# EAGLE design W506E (EAGLE 6.6.0)
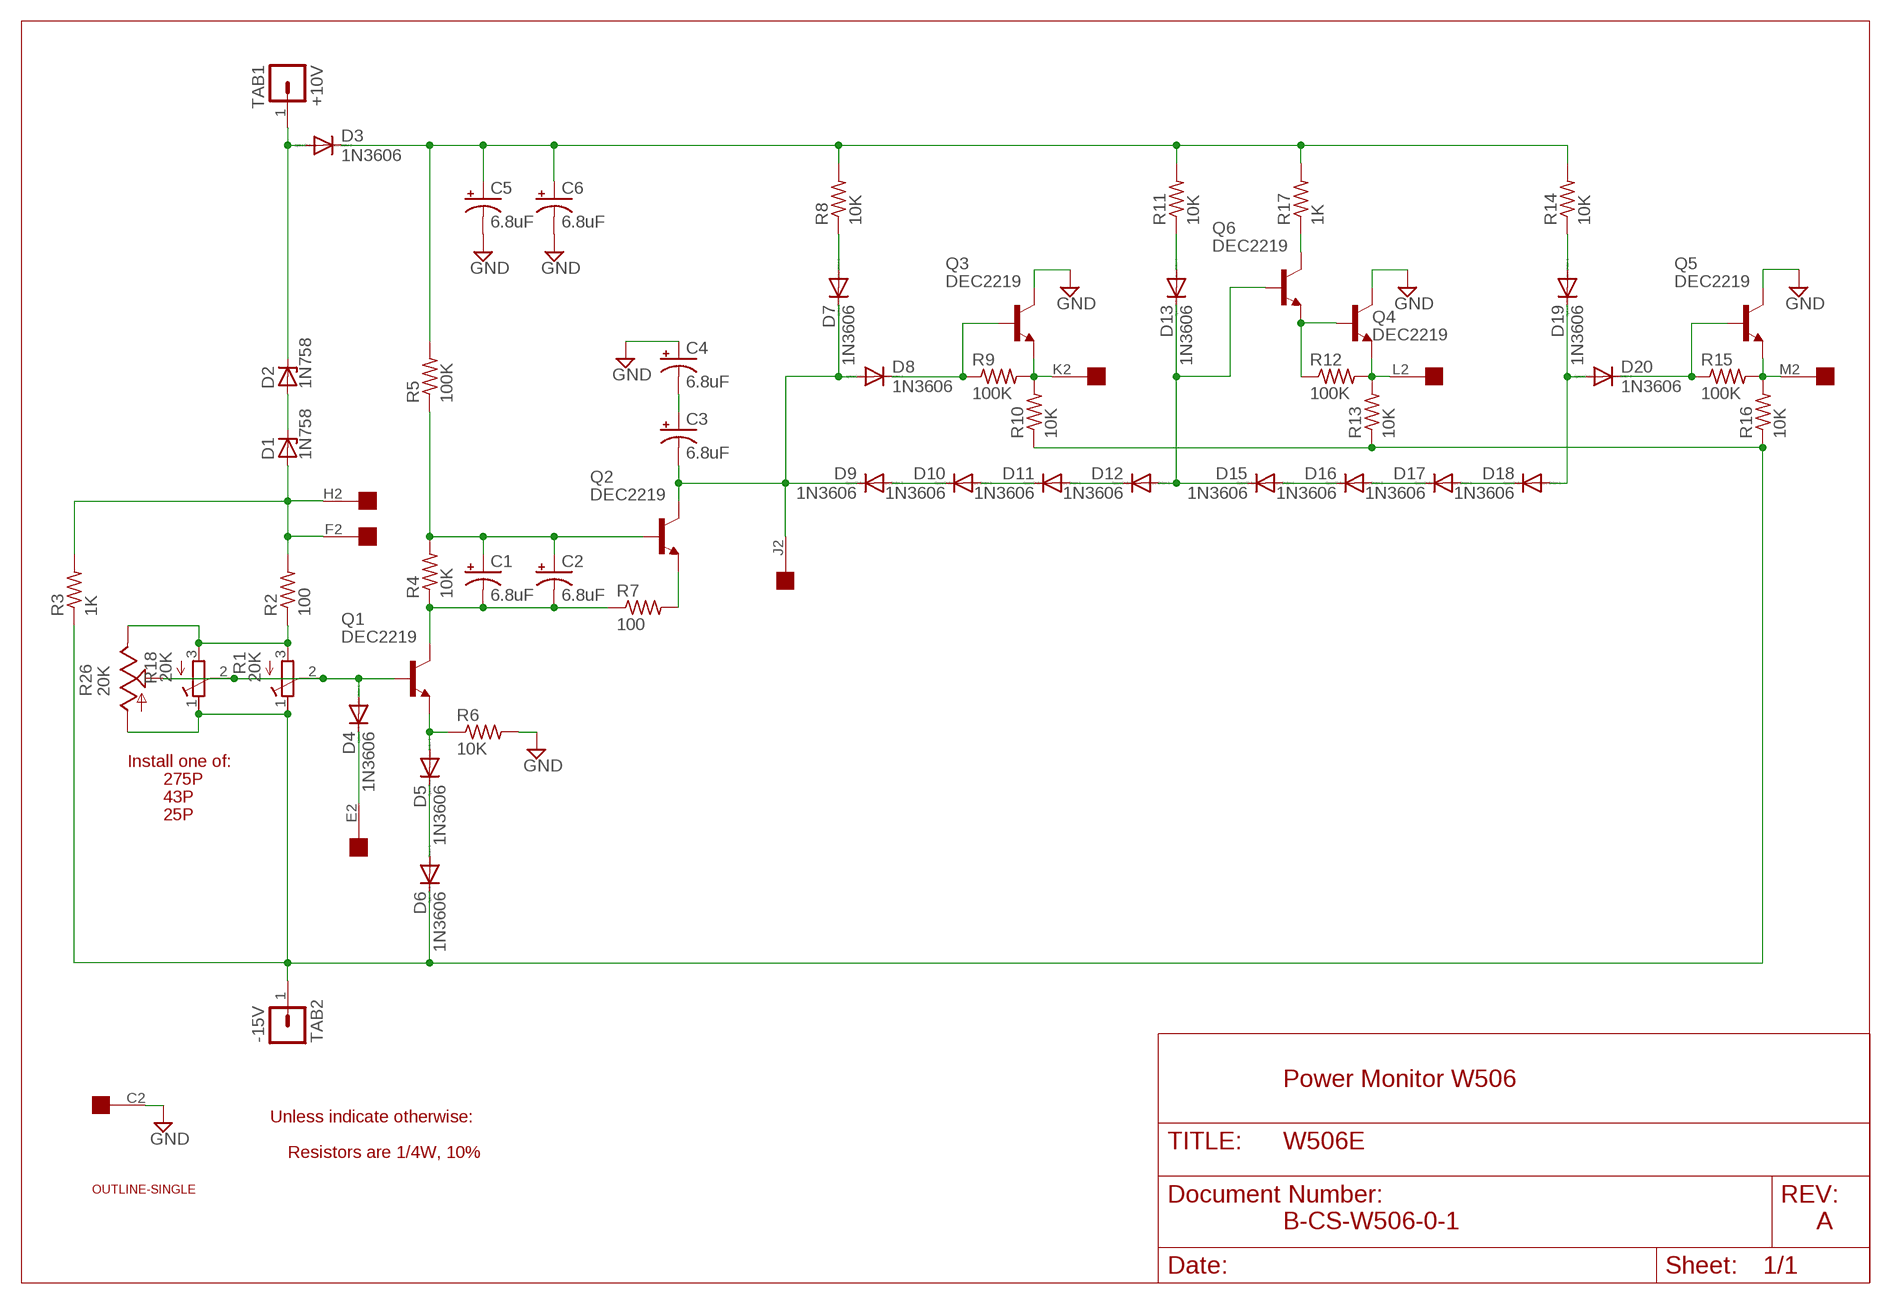
[diagram p0: schematic, sheet 1]

## Parts
C1  6.8uF  CPOL-USE15-5AXIAL  [E15-5]
C2  6.8uF  CPOL-USE15-5AXIAL  [E15-5]
C3  6.8uF  CPOL-USE15-5AXIAL  [E15-5]
C4  6.8uF  CPOL-USE15-5AXIAL  [E15-5]
C5  6.8uF  CPOL-USE15-5AXIAL  [E15-5]
C6  6.8uF  CPOL-USE15-5AXIAL  [E15-5]
D1  1N758  ZENER-DIODEDO35Z10  [DO35Z10]
D2  1N758  ZENER-DIODEDO35Z10  [DO35Z10]
D3  1N3606  1N4148DO35-10  [DO35-10]
D4  1N3606  1N4148DO35-10  [DO35-10]
D5  1N3606  1N4148DO35-10  [DO35-10]
D6  1N3606  1N4148DO35-10  [DO35-10]
D7  1N3606  1N4148DO35-10  [DO35-10]
D8  1N3606  1N4148DO35-10  [DO35-10]
D9  1N3606  1N4148DO35-10  [DO35-10]
D10  1N3606  1N4148DO35-10  [DO35-10]
D11  1N3606  1N4148DO35-10  [DO35-10]
D12  1N3606  1N4148DO35-10  [DO35-10]
D13  1N3606  1N4148DO35-10  [DO35-10]
D15  1N3606  1N4148DO35-10  [DO35-10]
D16  1N3606  1N4148DO35-10  [DO35-10]
D17  1N3606  1N4148DO35-10  [DO35-10]
D18  1N3606  1N4148DO35-10  [DO35-10]
D19  1N3606  1N4148DO35-10  [DO35-10]
D20  1N3606  1N4148DO35-10  [DO35-10]
EDGE  EDGE-1  [EDGE-CON1]
Q1  DEC2219  2N2102  [TO5]
Q2  DEC2219  2N2102  [TO5]
Q3  DEC2219  2N2102  [TO5]
Q4  DEC2219  2N2102  [TO5]
Q5  DEC2219  2N2102  [TO5]
Q6  DEC2219  2N2102  [TO5]
R1  20K  275P  [3006Y]
R2  100  R-US_0207/10  [0207/10]
R3  1K  R-US_0207/10  [0207/10]
R4  10K  R-US_0207/10  [0207/10]
R5  100K  R-US_0207/10  [0207/10]
R6  10K  R-US_0207/10  [0207/10]
R7  100  R-US_0207/10  [0207/10]
R8  10K  R-US_0207/10  [0207/10]
R9  100K  R-US_0207/10  [0207/10]
R10  10K  R-US_0207/10  [0207/10]
R11  10K  R-US_0207/10  [0207/10]
R12  100K  R-US_0207/10  [0207/10]
R13  10K  R-US_0207/10  [0207/10]
R14  10K  R-US_0207/10  [0207/10]
R15  100K  R-US_0207/10  [0207/10]
R16  10K  R-US_0207/10  [0207/10]
R17  1K  R-US_0207/10  [0207/10]
R18  20K  R-TRIMM43P  [RTRIM43P]
R26  20K  TRIM_US-B25P  [B25P]
TAB1  +10V  LUG  [SPADELUG]
TAB2  -15V  LUG  [SPADELUG]
U$1  OUTLINE-SINGLE  [SINGLE]

## Nets
+10V [Supply]: D2.C D3.A TAB1.1
-15V [Supply]: D6.C R1.1(A) R3.1 R10.1 R13.1 R16.1 R18.1(E) R26.A TAB2.1
GND [Supply]: C4.+ C5.- C6.- EDGE.C2 Q3.3(C) Q4.3(C) Q5.3(C) R6.2
N$1: R1.3(E) R2.1 R18.3(A) R26.E
N$2: D1.C D2.A
N$3: D1.A EDGE.F2 EDGE.H2 R2.2 R3.2
N$4: C1.- C2.- Q1.3(C) R4.1 R7.1
N$5: Q6.3(C) R17.1
N$6: D4.A Q1.2(B) R1.2(S) R18.2(S) R26.S
N$7: D4.C EDGE.E2
N$8: D5.C D6.A
N$9: D5.A Q1.1(E) R6.1
N$10 [Supply]: C5.+ C6.+ D3.C R5.2 R8.2 R11.2 R14.2 R17.2
N$11: C1.+ C2.+ Q2.2(B) R4.2 R5.1
N$13: Q2.1(E) R7.2
N$14: C3.+ C4.-
N$15: EDGE.M2 Q5.1(E) R15.2 R16.2
N$16: C3.- D7.C D8.A D9.C EDGE.J2 Q2.3(C)
N$17: D9.A D10.C
N$18: D10.A D11.C
N$19: D11.A D12.C
N$20: D7.A R8.1
N$21: D8.C Q3.2(B) R9.1
N$23: EDGE.K2 Q3.1(E) R9.2 R10.2
N$24: D12.A D13.C D15.C Q6.2(B)
N$25: D13.A R11.1
N$26: EDGE.L2 Q4.1(E) R12.2 R13.2
N$27: Q4.2(B) Q6.1(E) R12.1
N$29: D15.A D16.C
N$30: D16.A D17.C
N$31: D17.A D18.C
N$33: D20.C Q5.2(B) R15.1
N$34: D19.A R14.1
N$35: D18.A D19.C D20.A
Unconnected: EDGE.A2 EDGE.B2 EDGE.D2 EDGE.N2 EDGE.P2 EDGE.R2 EDGE.S2 EDGE.T2 EDGE.U2 EDGE.V2

## Notes on the sheet
- Install one of:
- 275P
- 43P
- 25P
- Power Monitor W506
- Unless indicate otherwise:
- Resistors are 1/4W, 10%
- B-CS-W506-0-1 | A

## Library data of the parts
C1-C6 = rcl:CPOL-US: POLARIZED CAPACITOR, American symbol
D1 D2 = diode:ZENER-DIODE: Z-Diode
D3-D13 D15-D20 = diode:1N4148: DIODE high speed (Philips)
EDGE = dec-con:EDGE-1: Single-Sided DEC Edge Connector -- (side 2)
Q1-Q6 = transistor-npn:2N2102: NPN Transistor
R1 = dec-con:275P: Trimpot with 275P (3006Y) footprint.
R2-R17 = rcl:R-US_: RESISTOR, American symbol
R18 = rcl:R-TRIMM: Trimm resistor
R26 = pot:TRIM_US-: POTENTIOMETER
TAB1 TAB2 = dec-con:LUG: Spade Lug
U$1 = dec-con:OUTLINE-*: Board outlines for DEC boards.

## Net classes
0 default: width 0.813 mm
1 Supply: width 0.813 mm

## Board
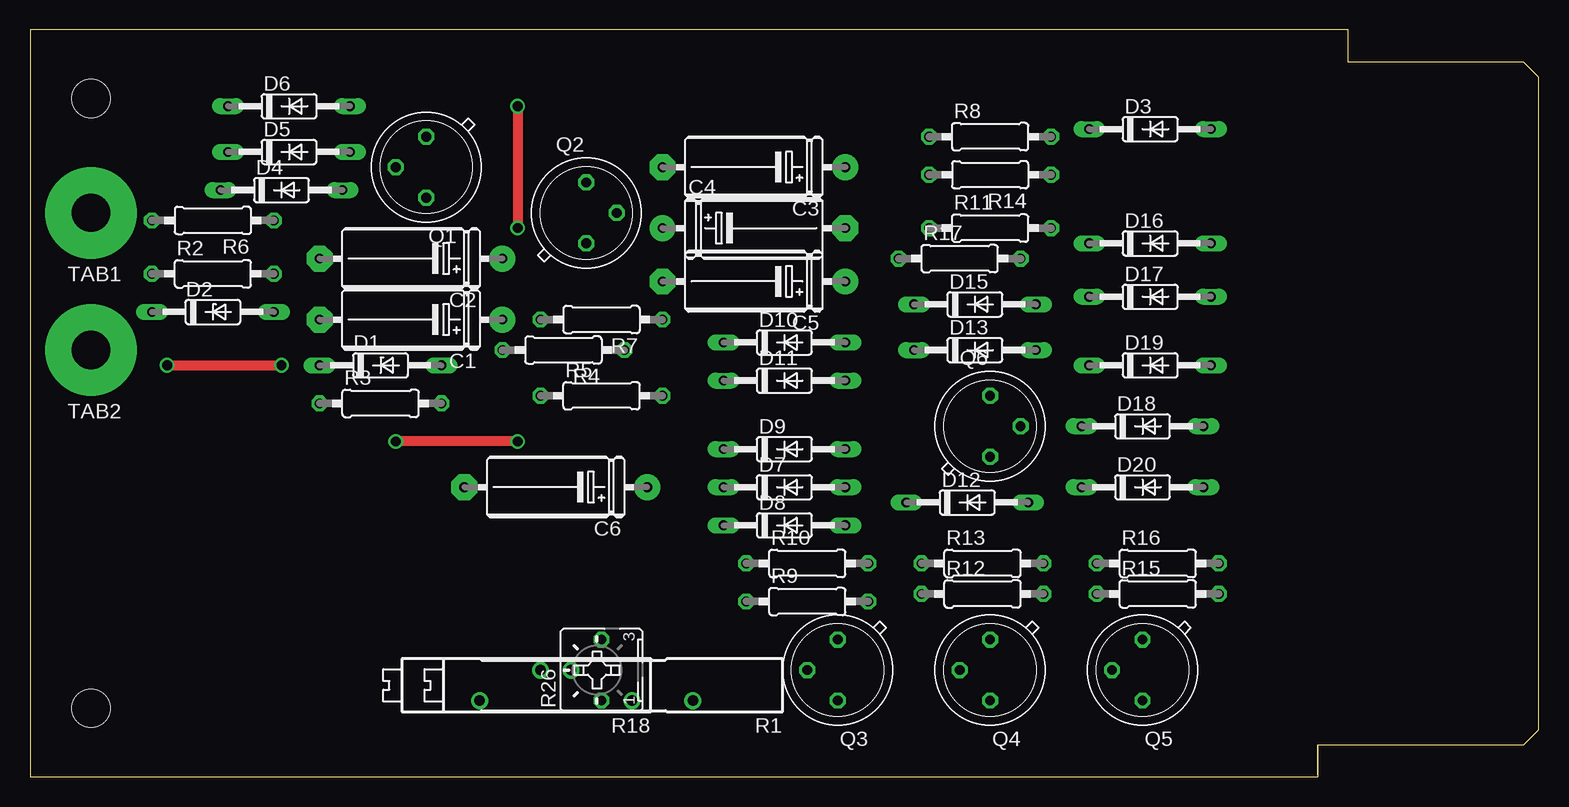
[diagram p1: board, top side]
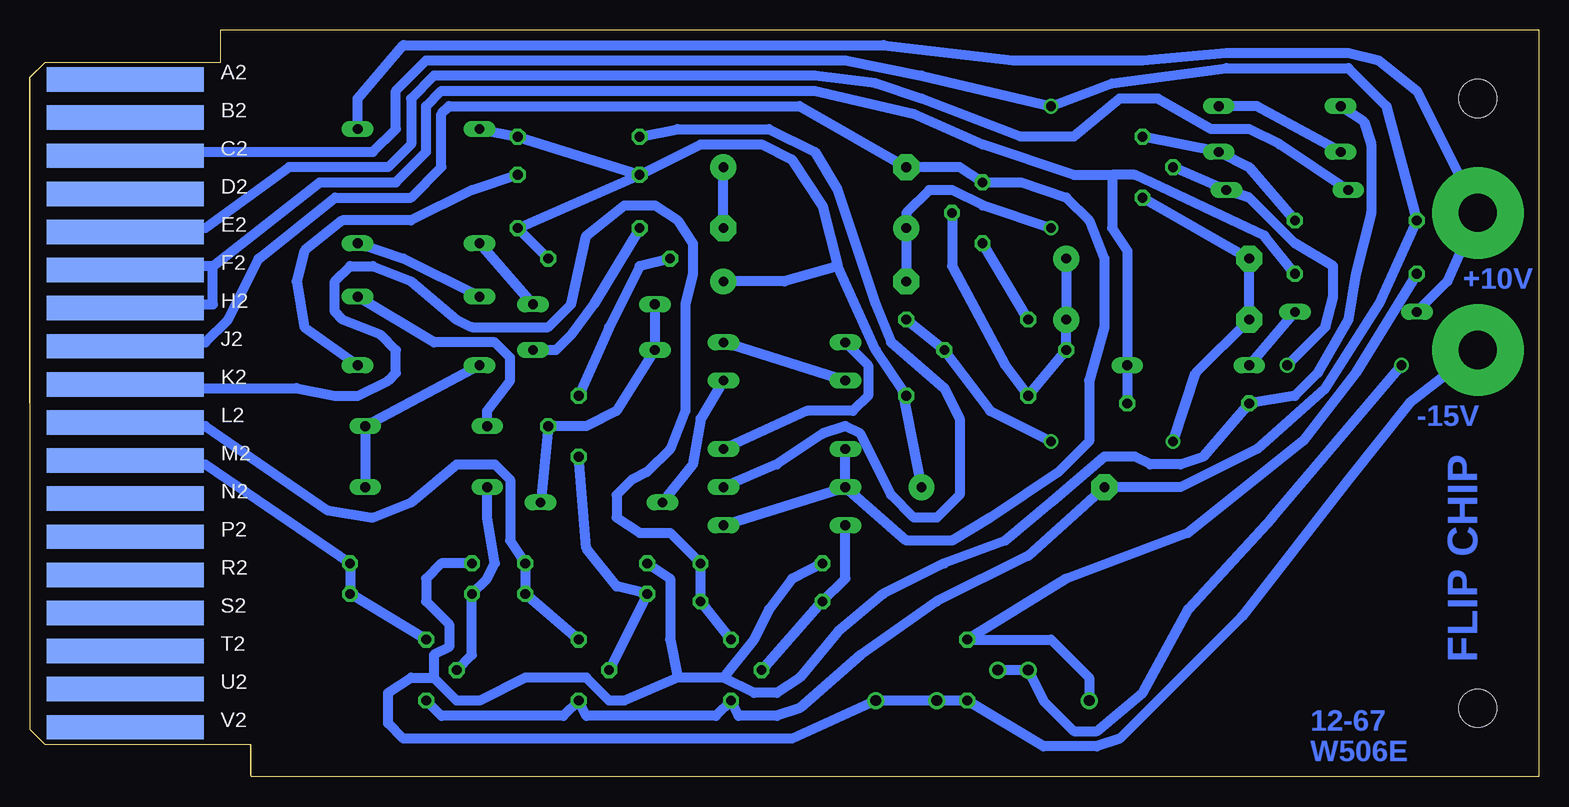
[diagram p2: board, bottom side, seen from below]

Size 125.73 x 62.23 mm. Coordinates in mm from the lower left corner, seen from the top.
Copper layers (1+16): Top 0.035mm / dielectric 1.5mm / Bottom 0.035mm
Design rules "16mils": minimum track width 16mil, minimum drill 32mil, track to track 15mil, track to pad 10mil, pad to pad 10mil, via to via 10mil, smd to smd 10mil, copper to edge 13mil, drill to drill 10mil, minimum pad ring 10mil, minimum via ring 8mil, stop-mask expansion 0mil, vias tented up to drill 0mil, thermal gap 10mil

### Footprints (pad centres in the part's own frame; a part is rotated, then mirrored left to right if it is on the bottom)
E15-5 = drill 0.813 pad 2.159: + -7.62,0 | drill 0.813 pad 2.159 octagon: - 7.62,0
DO35Z10 = drill 0.813 long: A 5.08,0; C -5.08,0
DO35-10 = drill 0.813 long: A 5.08,0; C -5.08,0
EDGE-CON1 = smd 13.106 x 2.032 bottom: A2 7.938,4.128; B2 7.938,7.303; C2 7.938,10.477; D2 7.938,13.652; E2 7.938,16.828; F2 7.938,20.003; H2 7.938,23.177; J2 7.938,26.352; K2 7.938,29.527; L2 7.938,32.703; M2 7.938,35.877; N2 7.938,39.053; P2 7.938,42.227; R2 7.938,45.403; S2 7.938,48.578; T2 7.938,51.752; U2 7.938,54.928; V2 7.938,58.102
TO5 = drill 0.813 octagon: 1 0,-2.54; 2 2.54,0; 3 0,2.54
3006Y = drill 0.9: 1 -8.89,1.27; 2 1.27,-1.27; 3 8.89,1.27
0207/10 = drill 0.813 octagon: 1 -5.08,0; 2 5.08,0
RTRIM43P = drill 0.9: 1 -7.62,1.27; 2 0,-1.27; 3 5.08,1.27
B25P = drill 0.813 octagon: A -2.54,0; E 2.54,0; S 0,2.54
SPADELUG = drill 3.175 pad 7.62: 1 0,0
SINGLE = hole 3.175: 120.65,56.515; 120.65,5.715

### Placement (x,y rotation side)
C1  31.75,38.1 180 top
C2  31.75,43.18 180 top
C3  60.33,50.8 180 top
C4  60.33,45.72 0 top
C5  60.33,41.27 180 top
C6  43.81,24.13 180 top
D1  29.21,34.29 0 top
D2  15.24,38.73 0 top
D3  93.34,53.98 0 top
D4  20.95,48.9 0 top
D5  21.59,52.07 0 top
D6  21.59,55.88 0 top
D7  62.87,24.13 0 top
D8  62.87,20.95 0 top
D9  62.87,27.3 0 top
D10  62.87,36.2 0 top
D11  62.87,33.02 0 top
D12  78.11,22.86 0 top
D13  78.74,35.56 0 top
D15  78.74,39.37 0 top
D16  93.34,44.45 0 top
D17  93.34,40.01 0 top
D18  92.71,29.21 0 top
D19  93.34,34.29 0 top
D20  92.71,24.13 0 top
EDGE  125.73,62.23 180 top
Q1  33.02,50.8 180 top
Q2  46.35,46.99 0 top
Q3  67.31,8.89 180 top
Q4  80.01,8.89 180 top
Q5  92.71,8.89 180 top
Q6  80.01,29.21 0 top
R1  46.35,7.62 180 top
R2  15.24,41.91 0 top
R3  29.21,31.11 0 top
R4  44.45,35.56 180 top
R5  47.62,31.75 0 top
R6  15.24,46.35 180 top
R7  47.62,38.1 180 top
R8  80.01,53.34 0 top
R9  64.77,14.61 0 top
R10  64.77,17.78 0 top
R11  80.01,45.72 0 top
R12  79.38,15.24 0 top
R13  79.38,17.78 0 top
R14  80.01,50.16 180 top
R15  93.98,15.24 0 top
R16  93.98,17.78 0 top
R17  77.47,43.18 0 top
R18  42.55,7.62 180 top
R26  47.62,8.89 90 top
TAB1  5.08,46.99 180 top
TAB2  5.08,35.56 180 top
U$1  125.73,62.23 180 top

### Tracks (layer width: path | path; a pad name or v marks a point on that pad's centre or on a via)
+10V
  Bottom 0.813: D2.C 7.62,41.27 TAB1.1 10.16,57.15 13.34,59.69 15.88,60.33 26.04,60.33 33.02,59.69 43.81,59.69 54.61,60.96 94.61,60.96 98.42,56.52 D3.A
-15V
  Bottom 0.813: TAB2.1 10.79,31.11 15.88,24.77 24.77,13.34 34.92,3.17 36.83,2.54 41.27,2.54 R26.A R18.1 R1.1 62.23,3.17 94.61,3.17 95.89,4.45 95.89,6.99 93.98,8.26 92.08,8.26 | D6.C 14.61,54.61 13.97,52.7 13.97,46.99 15.24,41.91 15.88,38.1 18.41,33.66 20.32,31.75 R3.1 27.94,26.67 29.84,26.04 32.38,26.04 33.66,26.67 36.2,26.67 40.64,22.86 44.45,19.68 49.53,17.78 54.61,15.24 58.42,12.06 61.59,8.26 63.5,6.99 65.41,6.99 67.94,8.26 | R16.1 91.44,17.78 92.71,16.51 92.71,14.61 90.81,12.7 90.81,10.79 92.08,10.16 92.08,8.26 | R13.1 72.39,16.51 72.39,11.43 71.75,8.26 | 71.75,8.26 76.2,6.35 77.47,6.35 79.38,8.26 84.45,8.26 88.27,6.35 90.17,6.35 92.08,8.26 | 67.94,8.26 71.75,8.26 | R10.1 62.23,16.51 64.14,13.97 65.41,11.43 67.94,8.26
GND  (via drill 0.81)
  Top 0.813: v40.64,55.88 v40.64,45.72
  Bottom 0.813: Q5.3 91.44,5.08 81.28,5.08 Q4.3 79.38,5.08 68.58,5.08 Q3.3 66.67,5.08 63.5,5.08 61.59,5.71 56.52,10.16 50.16,14.61 42.55,18.41 C6.- 29.84,24.13 23.5,27.3 17.78,32.38 13.34,39.37 R6.2 12.7,55.88 15.88,59.05 26.04,59.05 35.56,57.78 v40.64,55.88 51.44,58.42 57.78,59.69 92.71,59.69 95.25,57.15 95.25,53.98 97.16,52.07 116.84,52.07 EDGE.C2 | C5.- C4.+ 52.7,46.99 50.8,48.9 48.9,48.9 46.35,47.62 v40.64,45.72
N$1
  Bottom 0.813: R18.3 37.47,8.26 40.64,11.43 R26.E 39.37,16.51 29.21,20.32 19.68,27.94 15.24,33.66 R2.1
N$2
  Bottom 0.813: D2.A D1.C
N$3
  Bottom 0.813: R2.2 22.86,45.09 33.66,50.16 35.56,50.16 | 35.56,50.16 35.56,45.72 34.29,43.81 D1.A R3.2 | EDGE.H2 116.84,39.37 110.49,39.37 110.49,42.55 | 110.49,42.55 116.84,42.55 EDGE.F2 | 110.49,42.55 101.6,49.53 95.25,49.53 92.71,52.07 92.71,55.88 91.44,57.15 60.33,57.15 52.07,55.24 46.35,52.7 38.73,50.16 35.56,50.16
N$4  (via drill 0.81)
  Top 0.813: v40.64,27.94 v30.48,27.94
  Bottom 0.813: Q1.3 C2.- C1.- 28.57,33.66 v30.48,27.94 | R7.1 R4.1 45.72,30.48 v40.64,27.94
N$5
  Bottom 0.813: R17.1 74.93,42.55 77.47,37.47 Q6.3
N$6  (via drill 0.81)
  Top 0.813: v11.43,34.29 v20.95,34.29
  Bottom 0.813: R26.S R18.2 41.27,6.35 38.73,3.81 36.83,3.81 33.02,6.99 29.21,13.97 22.23,21.59 v11.43,34.29 | v20.95,34.29 17.78,37.47 17.14,40.01 17.14,42.55 20.32,44.45 24.13,48.26 D4.A Q1.2
N$7
  Bottom 0.813: D4.C 21.59,52.7 24.13,53.98 27.3,53.98 31.75,56.52 34.92,56.52 38.73,53.34 43.18,53.34 51.44,56.52 55.24,57.78 60.33,58.42 92.08,58.42 93.98,56.52 93.98,52.7 95.89,50.8 104.14,50.8 111.12,45.72 117.47,45.72 EDGE.E2
N$8
  Bottom 0.813: D5.C 23.5,55.88 D6.A
N$9
  Bottom 0.813: Q1.1 D5.A 24.13,50.8 R6.1
N$10
  Bottom 0.813: R5.2 53,32.19 | 53,32.19 55.24,35.56 58.42,42.55 | 58.42,42.55 62.87,41.27 C5.+ | R14.2 69.85,52.7 64.77,52.7 62.23,51.44 59.69,47.62 58.42,42.55 | C6.+ 53,32.19 | D3.C R8.2 R14.2 | R14.2 R11.2 R17.2
N$11
  Bottom 0.813: C2.+ C1.+ R4.2 R5.1 44.45,34.29 48.9,42.55 Q2.2
N$13
  Bottom 0.813: R7.2 Q2.1
N$14
  Bottom 0.813: C4.- C3.+
N$15
  Bottom 0.813: Q5.1 R15.2 R16.2 111.12,26.04 115.57,26.04 EDGE.M2
N$16
  Bottom 0.813: D8.A D7.C | D7.C D9.C | EDGE.J2 116.84,36.2 111.12,36.2 109.22,38.1 106.68,43.18 100.33,48.26 93.98,48.26 91.44,50.8 91.44,55.24 90.81,55.88 61.59,55.88 C3.- 48.26,50.8 Q2.3 43.18,49.53 39.37,48.26 37.47,46.35 36.2,43.18 36.2,37.47 37.47,33.02 37.47,27.94 40.01,25.4 45.72,21.59 48.9,19.68 52.7,19.68 D7.C
N$17
  Bottom 0.813: D10.C 55.88,34.29 55.88,31.75 57.15,30.48 60.96,30.48 D9.A
N$18
  Bottom 0.813: D11.C D10.A
N$19
  Bottom 0.813: D11.A 69.85,29.84 70.48,26.04 D12.C
N$20
  Bottom 0.813: R8.1 71.75,53.98 64.14,53.98 60.33,52.07 58.42,48.9 55.24,39.37 53.98,36.2 49.53,32.38 48.26,29.84 48.26,23.5 50.16,21.59 52.07,21.59 53.98,23.5 56.52,28.57 57.78,29.21 59.69,28.57 63.5,26.04 D7.A
N$21
  Bottom 0.813: Q3.2 R9.1 57.78,16.51 D8.C
N$23
  Bottom 0.813: Q3.1 R9.2 R10.2 72.39,20.32 74.93,20.32 76.83,21.59 76.83,23.5 75.56,24.77 74.3,25.4 72.39,27.3 71.12,30.48 71.12,39.37 70.48,41.91 70.48,44.45 71.75,46.35 73.66,47.62 76.2,47.62 79.38,45.09 80.64,39.37 82.55,37.47 88.9,37.47 90.17,38.1 93.98,41.27 97.16,42.55 99.06,42.55 100.33,41.27 100.33,38.73 99.69,38.1 96.52,36.83 95.25,35.56 95.25,33.66 95.89,33.02 98.42,31.75 100.33,31.75 103.5,32.38 116.2,32.38 EDGE.K2
N$24
  Bottom 0.813: D15.C D13.C 76.83,30.48 79.38,29.21 Q6.2 D12.A
N$25
  Bottom 0.813: R11.1 78.74,39.37 80.64,36.83 81.92,35.56 D13.A
N$26
  Bottom 0.813: Q4.1 R12.2 R13.2 85.72,19.68 85.72,24.77 87,26.04 90.17,26.04 93.98,22.86 97.16,21.59 100.97,22.23 111.12,29.21 EDGE.L2
N$27
  Bottom 0.813: Q4.2 R12.1 76.83,15.88 79.38,19.05 Q6.1
N$29
  Bottom 0.813: D15.A D16.C
N$30
  Bottom 0.813: D17.C 94.61,43.18 D16.A
N$31
  Bottom 0.813: D18.C 87.63,30.48 85.72,33.02 85.72,34.92 87,36.2 92.08,36.2 D17.A
N$33
  Bottom 0.813: Q5.2 88.9,10.16 R15.1 87.63,16.51 87,17.78 87.63,21.59 D20.C
N$34
  Bottom 0.813: R14.1 88.9,48.9 93.98,46.35 99.69,46.35 102.87,43.81 103.5,41.27 102.87,37.47 D19.A
N$35
  Bottom 0.813: D20.A D18.A D19.C

### Text on the board
Bottom: +10V | -15V | FLIP CHIP | 12-67 | W506E
200bmp: C:/Users/Vince/Documents/eagle/projects/DEC/Wxxx/W506/W506Ebackfb.bmp